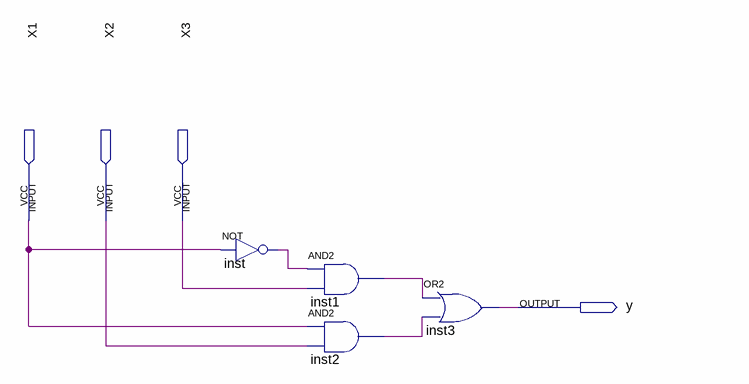
[diagram p0: schematic sheet]
// Quartus schematic scheme3.bdf as structural Verilog: 4 symbols, 4 pins
module scheme3 (
  input  X1,
  input  X2,
  input  X3,
  output y
);

  wire inst1_out, inst2_out, inst_out;

  not inst (inst_out, X1);
  and inst1 (inst1_out, inst_out, X3);
  and inst2 (inst2_out, X1, X2);
  or inst3 (y, inst1_out, inst2_out);
endmodule
